# Altium schematic sheet Base_Schematic.SchDoc
size A4; SheetNumber: 1; SheetTotal: 2; ENG_APP_DATE: --/--/--; DSN_APP_DATE: --/--/--; CHK_APP_DATE: --/--/--
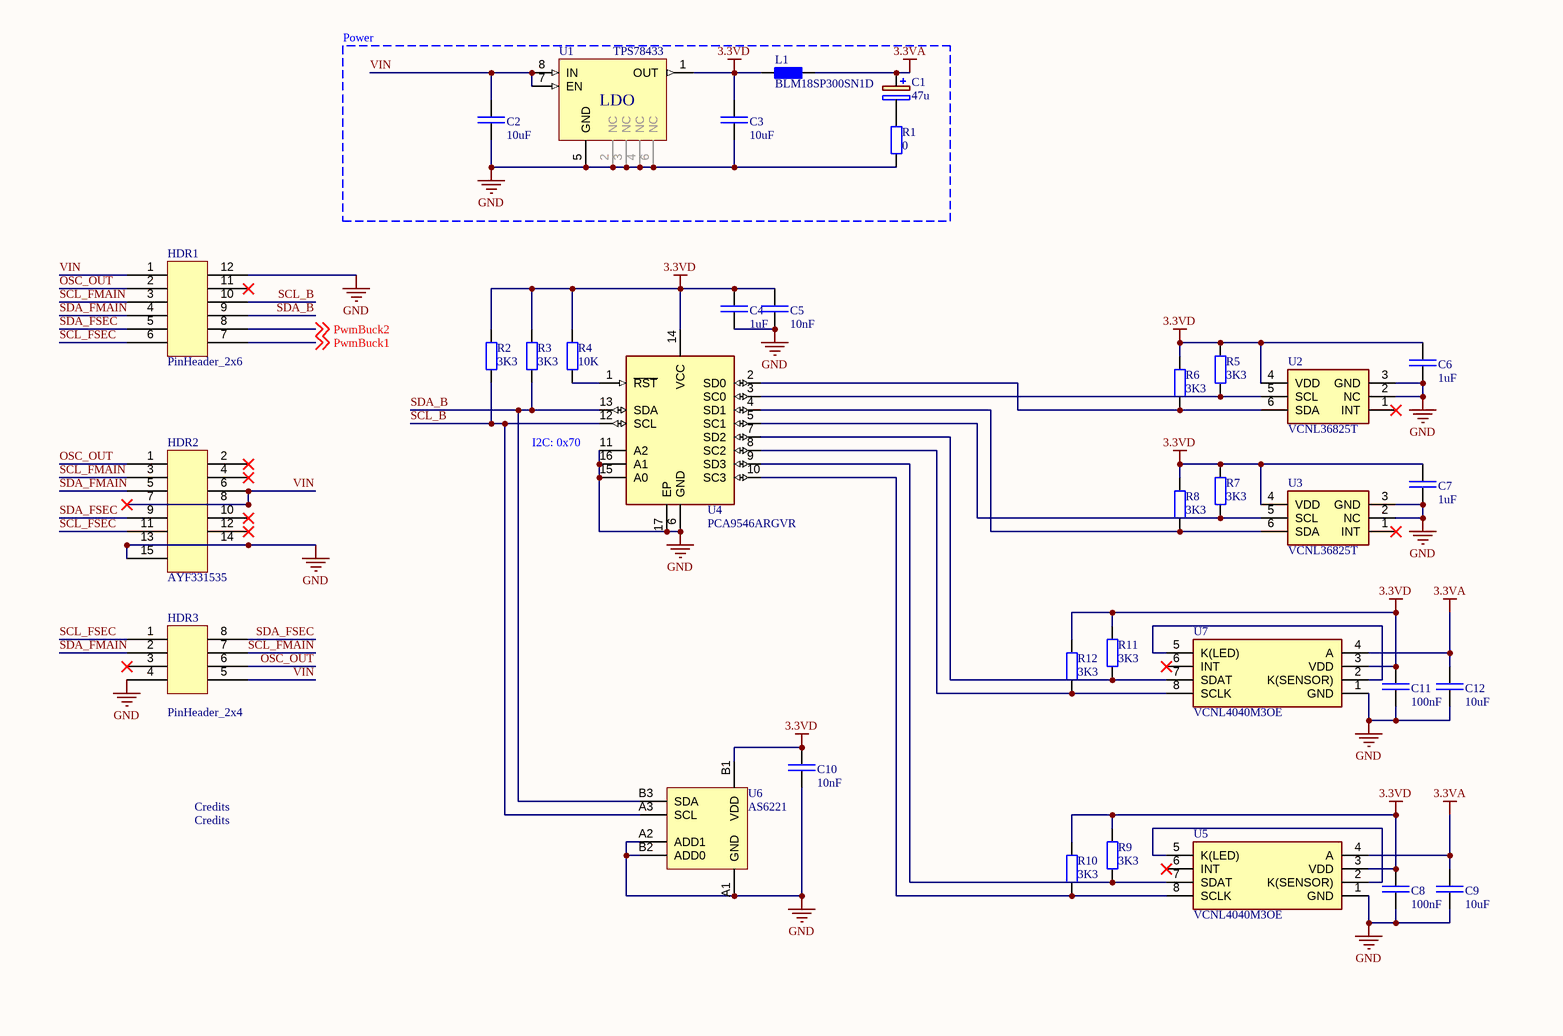
[diagram p0: Base_Schematic.SchDoc]

## Parts
C1  47u  [CAPAE7366X61N]
C2  10uF  [CAP_SM0805_YAGEOCC2_N]
C3  10uF  [CAP_SM0805_YAGEOCC2_N]
C4  1uF  [CAP_SM0805_YAGEOCC2_N]
C5  10nF  [CAP_SM0402_YAGEOCC2_N]
C6  1uF  [CAP_SM0805_YAGEOCC2_N]
C7  1uF  [CAP_SM0805_YAGEOCC2_N]
C8  100nF  [CAP_SM0603_YAGEOCC2_N]
C9  10uF  [CAP_SM0805_YAGEOCC2_N]
C10  10nF  [CAP_SM0402_YAGEOCC2_N]
C11  100nF  [CAP_SM0603_YAGEOCC2_N]
C12  10uF  [CAP_SM0805_YAGEOCC2_N]
Credit  Credits  [CREDITS_CU+TS_SIGNED]
HDR1  PinHeader_2x6  [PinHeader_2x6_2.54mm]
HDR2  AYF331535  [AYF331535 _Reverse]
HDR3  PinHeader_2x4  [PinHeader_2x4_2.54mm]
L1  BLM18SP300SN1D  [Chip2PinSM127P600-8N]
R1  0  [RES_SM0603_YAGEORC_N]
R2  3K3  [RES_SM0603_YAGEORC_N]
R3  3K3  [RES_SM0603_YAGEORC_N]
R4  10K  [RES_SM0603_YAGEORC_N]
R5  3K3  [RES_SM0603_YAGEORC_N]
R6  3K3  [RES_SM0603_YAGEORC_N]
R7  3K3  [RES_SM0603_YAGEORC_N]
R8  3K3  [RES_SM0603_YAGEORC_N]
R9  3K3  [RES_SM0603_YAGEORC_N]
R10  3K3  [RES_SM0603_YAGEORC_N]
R11  3K3  [RES_SM0603_YAGEORC_N]
R12  3K3  [RES_SM0603_YAGEORC_N]
U1  TPS78433  [TPS784xxxQDRBRQ1_SON]
U2  VCNL36825T  [VCNL36825T]
U3  VCNL36825T  [VCNL36825T]
U4  PCA9546ARGVR  [QFN65P400X400X100-17N-D]
U5  VCNL4040M3OE  [VCNL4040M3OE]
U6  AS6221  [AS6221_BGA_LargePads]
U7  VCNL4040M3OE  [VCNL4040M3OE]

## Blocks framed on the sheet
Power: C1-C3 L1 R1 U1

## Nets
3.3VA: C1.1(+) C9.1 C12.1 L1.2 U5.4(A) U7.4(A)
3.3VD: C3.1 C4.1 C5.1 C6.1 C7.1 C8.1 C10.1 C11.1 L1.1 R2.1 R3.1 R4.1 R5.2 R6.2 R7.2 R8.2 R9.2 R10.2 R11.2 R12.2 U1.1(OUT) U2.4(VDD) U3.4(VDD) U4.14(VCC) U5.3(VDD) U6.B1(VDD) U7.3(VDD)
GND: C2.2 C3.2 C4.2 C5.2 C6.2 C7.2 C8.2 C9.2 C10.2 C11.2 C12.2 HDR1.12 HDR2.13 HDR2.14 HDR2.15 HDR3.4 R1.1 U1.2(NC) U1.3(NC) U1.4(NC) U1.5(GND) U1.6(NC) U2.2(NC) U2.3(GND) U3.2(NC) U3.3(GND) U4.6(GND) U4.11(A2) U4.15(A0) U4.16(A1) U4.17(EP) U5.1(GND) U6.A1(GND) U6.A2(ADD1) U6.B2(ADD0) U7.1(GND)
OSC_OUT: HDR1.2 HDR2.1 HDR3.6
PwmBuck1: HDR1.7 ; off-sheet PwmBuck1
PwmBuck2: HDR1.8 ; off-sheet PwmBuck2
SCL_B: HDR1.10 R2.2 U4.12(SCL) U6.A3(SCL)
SCL_FMAIN: HDR1.3 HDR2.3 HDR3.7
SCL_FSEC: HDR1.6 HDR2.11 HDR3.1
SDA_B: HDR1.9 R3.2 U4.13(SDA) U6.B3(SDA)
SDA_FMAIN: HDR1.4 HDR2.5 HDR3.2
SDA_FSEC: HDR1.5 HDR2.9 HDR3.8
VIN: C2.1 HDR1.1 HDR2.6 HDR2.7 HDR2.8 HDR3.5 U1.7(EN) U1.8(IN)
NetC1_2: C1.2(-) R1.2
NetR4_2: R4.2 U4.1(~{RST})
NetR5_1: R5.1 U2.5(SCL) U4.3(SC0)
NetR6_1: R6.1 U2.6(SDA) U4.2(SD0)
NetR7_1: R7.1 U3.5(SCL) U4.5(SC1)
NetR8_1: R8.1 U3.6(SDA) U4.4(SD1)
NetR9_1: R9.1 U4.9(SD3) U5.7(SDAT)
NetR10_1: R10.1 U4.10(SC3) U5.8(SCLK)
NetR11_1: R11.1 U4.7(SD2) U7.7(SDAT)
NetR12_1: R12.1 U4.8(SC2) U7.8(SCLK)
NetU5_2: U5.2(K(SENSOR)) U5.5(K(LED))
NetU7_2: U7.2(K(SENSOR)) U7.5(K(LED))

Not connected (* = marked no-connect by the designer): HDR1 11*; HDR2 2* 4* 10* 12*; HDR3 3*; U2 1(INT)*; U3 1(INT)*; U5 6(INT)*; U7 6(INT)*

## Notes on the sheet
- (near U4) I2C: 0x70
- DWG. NO.
- REV.
- SHT.
- THIS DOCUMENT AND THE DATA DISCLOSED HEREIN OR HEREWITH IS THE PROPERTY OF ALTIUM LIMITED AND MAY BE FREELY DISTRIBUTED IN WHOLE. NO RIGHTS ARE RESERVED OR EXPRESS OR IMPLIED WARANTEE GIVEN.
- REVISION
- DESCRIPTION
- DATE
- APPROVED
- ENG:
- APPROVALS
- PROJECT
- DSN:
- CHK:
- REFERENCE DOCUMENTS
- PROJECT REVISION:
- TITLE
- DOCUMENT REVISION:
- DESIGN ITEM:
- BOM:
- FAB DWG:
- PCB DWG:
- ASSY DWG:
- SCALE:
- SIZE
- B
- CAGE CODE
- FILE NAME
- DWG NO.
- SHEET
- OF
- REV
- (in symbol TPS78433QWDRBRQ1) LDO

## Library data of the parts
C1 = EEE-FK1E470P: Aluminium Electrolytic Capacitors - SMD 47uF 25V; Value: 47u; Supplier 1: Mouser; Supplier Part Number 1: 667-EEE-FK1E470P; Supplier 2: Digi-Key; Supplier Part Number 2: PCE3804CT-ND; Supplier 3: Digi-Key; Supplier Part Number 3: PCE3804DKR-ND
C2 C3 C9 C12 = CC0805KKX5R8BB106: CAP 10uF SM0805 X5R 16V YAGEO CC2; Manufacturer Part Number: CC0805KKX7R8BB225; Tolerance (%): 10; Voltage Rating (Volts): 25; Category: Capacitor; Manufacturer: Yageo; Package: 0805; Value: 10uF; Supplier Part Number 1: 1988078; Supplier 1: Rs; ComponentLink1URL: http://www.yageo.com; ComponentLink1Description: Manufacturer Website; Supplier 2: Digikey; Supplier Part Number 2: 311-1869-1-ND; Supplier 3: Digikey; Supplier Part Number 3: 311-1869-6-ND; Supplier 4: Farnell; Supplier Part Number 4: 3369293; Supplier 5: Mouser; Supplier Part Number 5: 603-CC805KKX5R8BB106
C4 C6 C7 = CC0805KKX7R8BB105: CAP 1uF SM0805 X7R 25V YAGEO CC2; Tolerance (%): 10; Voltage Rating (Volts): 25; Category: Capacitor; Manufacturer: Yageo; Manufacturer Part Number: CC0805KKX7R8BB105; Package: 0805; Value: 1uF; ComponentLink1URL: http://www.yageo.com; ComponentLink1Description: Manufacturer Website; Supplier 1: Farnell; Supplier Part Number 1: 1458903; Supplier 2: Digikey; Supplier Part Number 2: 311-1456-1-ND; Supplier 3: Mouser; Supplier Part Number 3: 603-CC805KKX7R8BB105; Supplier 4: Future Electronics; Supplier Part Number 4: 7716954; Supplier 5: Arrow Electronics; Supplier Part Number 5: CC0805KKX7R8BB105; Supplier 6: Rs; Supplier Part Number 6: 1988104; Supplier 7: Digikey; Supplier Part Number 7: 311-1456-6-ND
C5 C10 = CC0402KRX7R9BB103: CAP 10nF SM0402 X7R 50V YAGEO CC2; Manufacturer Part Number: CC0603KRX7R9BB103; Tolerance (%): 10; Voltage Rating (Volts): 50; Category: Capacitor; Manufacturer: Yageo; Package: 0603; Value: 10nF; Supplier Part Number 1: 3369167; Supplier 1: Farnell; ComponentLink1URL: http://www.yageo.com; ComponentLink1Description: Manufacturer Website; Supplier 2: Mouser; Supplier Part Number 2: 603-CC402KRX7R9BB103; Supplier 3: DigiKey; Supplier Part Number 3: 311-1349-1-ND
C8 C11 = CC0603KRX7R9BB104: CAP 100nF SM0603 X7R 50V YAGEO CC2; Tolerance (%): 10; Voltage Rating (Volts): 50; Category: Capacitor; Manufacturer: Yageo; Manufacturer Part Number: CC0603KRX7R9BB104; Package: 0603; Value: 100nF; ComponentLink1URL: http://www.yageo.com; ComponentLink1Description: Manufacturer Website; Supplier 1: Mouser; Supplier Part Number 1: 603-CC603KRX7R9BB104; Supplier 2: Future Electronics; Supplier Part Number 2: 3035896; Supplier 3: Future Electronics; Supplier Part Number 3: 9017302; Supplier 4: Arrow Electronics; Supplier Part Number 4: CC0603KRX7R9BB104; Supplier 5: Rs; Supplier Part Number 5: 6698767; Supplier 6: Avnet; Supplier Part Number 6: 68R4788; Supplier 7: Digikey; Supplier Part Number 7: 311-1344-1-ND; Supplier 8: Digikey; Supplier Part Number 8: 311-1344-6-ND
HDR1 = PinHeader_2x6_2.54mm: PinHeader_2x6 2.54mm Pitch
HDR2 = AYF331535: AYF331535 FFC & FPC-Steckverbinder CONNECTOR SURFACE MOUNT; Supplier 1: Mouser; Supplier Part Number 1: 769-AYF331535; Supplier 2: Digi-Key; Supplier Part Number 2: 255-3053-1-ND
HDR3 = PinHeader_2x4_2.54mm: PinHeader_2x4 2.54mm Pitch
L1 = BLM18SP300SN1D: Ferrite Beads 0603 30ohm 10% 6A; Manufacturer_Name: Murata Electronics; Geometry.Height: 0.95mm; Mouser Part Number: 81-BLM18SP300SN1D; Mouser Price/Stock: https://www.mouser.co.uk/ProductDetail/Murata-Electronics/BLM18SP300SN1D?qs=W%2FMpXkg%252BdQ4o%252BOP%252B6m8FYA%3D%3D; Manufacturer_Part_Number: BLM18SP300SN1D; Datasheet Link: http://www.murata.com/~/media/webrenewal/support/library/catalog/products/emc/emifil/c31e.ashx?la=en-gb; Supplier 1: Digi-Key; Supplier Part Number 1: 490-BLM18SP300SN1DCT-ND; Supplier 2: Digi-Key; Supplier Part Number 2: 490-BLM18SP300SN1DDKR-ND; Supplier 3: Mouser; Supplier Part Number 3: 81-BLM18SP300SN1D
R1 = RC0603FR-070RL: RES 0R SM0603 YAGEO RC_L; Manufacturer Part Number: RC0603FR-0710KL; Power (Watts): 0.1; Resistance (Ohms): 10000; Tolerance (%): 1; Category: Resistor; Manufacturer: Yageo; Package: 0603; Value: 0; ComponentLink1URL: http://www.yageo.com; ComponentLink1Description: Manufacturer Website; Supplier 1: Digikey; Supplier Part Number 1: 311-0.0HRCT-ND; Supplier 2: Digikey; Supplier Part Number 2: 311-0.0HRDKR-ND; Supplier 3: Farnell; Supplier Part Number 3: 2309106; Supplier 4: Mouser; Supplier Part Number 4: 603-RC0603FR-070RL; Supplier 5: Newark; Supplier Part Number 5: 50Y7761
R2 R3 R5-R12 = RC0603FR-073K3L: RES 3K3 SM0603 YAGEO RC_L; Manufacturer Part Number: RC0603FR-0710KL; Power (Watts): 0.1; Resistance (Ohms): 10000; Tolerance (%): 1; Category: Resistor; Manufacturer: Yageo; Package: 0603; Value: 3K3; Supplier Part Number 1: 1995564; Supplier 1: Rs; ComponentLink1URL: http://www.yageo.com; ComponentLink1Description: Manufacturer Website; Supplier 2: Farnell; Supplier Part Number 2: 9238549; Supplier 3: Digikey; Supplier Part Number 3: 311-3.30KHRCT-ND; Supplier 4: Digikey; Supplier Part Number 4: 311-3.30KHRDKR-ND; Supplier 5: Mouser; Supplier Part Number 5: 603-RC0603FR-073K3L; Supplier 6: Newark; Supplier Part Number 6: 98K7393
R4 = RC0603FR-0710KL: RES 10K SM0603 YAGEO RC_L; Power (Watts): 0.1; Resistance (Ohms): 10000; Tolerance (%): 1; Category: Resistor; Manufacturer: Yageo; Manufacturer Part Number: RC0603FR-0710KL; Package: 0603; Value: 10K; Supplier Part Number 1: 9238603; Supplier 1: Farnell; ComponentLink1URL: http://www.yageo.com; ComponentLink1Description: Manufacturer Website; Supplier 2: Future Electronics; Supplier Part Number 2: 3349388; Supplier 3: Rs; Supplier Part Number 3: 1995443; Supplier 4: Digikey; Supplier Part Number 4: 311-10.0KHRCT-ND; Supplier 5: Digikey; Supplier Part Number 5: 311-10.0KHRDKR-ND; Supplier 6: Mouser; Supplier Part Number 6: 603-RC0603FR-0710KL; Supplier 7: Newark; Supplier Part Number 7: 98K7338
U1 = TPS78433QWDRBRQ1: TPS78433-Q1 3.3V, 300-mA, High-PSRR Low-Dropout Voltage Regulator With High Accuracy and Enable,  8-SON (3x3); Supplier 1: Mouser; Supplier Part Number 1: 595-TPS78433QWDRBRQ1; Supplier 2: Digikey; Supplier Part Number 2: 296-TPS78433QWDRBRQ1CT-ND; Supplier 3: Texas Instruments; Supplier Part Number 3: TPS78433QWDRBRQ1; Supplier 4: Digikey; Supplier Part Number 4: 296-TPS78433QWDRBRQ1DKR-ND; Supplier 5: Digikey; Supplier Part Number 5: 296-TPS78433QWDRBRQ1TR-ND; Supplier 6: LCSC; Supplier Part Number 6: C3747465
U2 U3 = VCNL36825T: Proximity Sensors PROX SENS INTER VCSEL I2C-E4, IC SENSORS; Manufacturer_Name: Vishay; Geometry.Height: 0.6mm; Mouser Part Number: 78-VCNL36825T; Mouser Price/Stock: https://www.mouser.co.uk/ProductDetail/Vishay-Semiconductors/VCNL36825T?qs=pUKx8fyJudAlmgCr9cmOAQ%3D%3D; Manufacturer_Part_Number: VCNL36825T; Datasheet Link: https://www.vishay.com/docs/80235/vcnl36825t.pdf; Supplier 1: Mouser; Supplier Part Number 1: 78-VCNL36825T; Supplier 2: Digi-Key; Supplier Part Number 2: 751-VCNL36825TCT-ND; Supplier 3: Digi-Key; Supplier Part Number 3: 751-VCNL36825TDKR-ND
U4 = PCA9546ARGVR: 4-Channel I2C And SMBus Switch With Reset Functions; Manufacturer_Name: Texas Instruments; Geometry.Height: 1mm; Mouser Part Number: 595-PCA9546ARGVR; Mouser Price/Stock: https://www.mouser.co.uk/ProductDetail/Texas-Instruments/PCA9546ARGVR?qs=iSMark9AYDVOIxSBd0ujBA%3D%3D; Manufacturer_Part_Number: PCA9546ARGVR; Datasheet Link: http://www.ti.com/lit/gpn/pca9546a; Supplier 1: Mouser; Supplier Part Number 1: 595-PCA9546ARGVR; Supplier 2: Digi-Key; Supplier Part Number 2: 296-21771-1-ND; Supplier 3: Digi-Key; Supplier Part Number 3: 296-21771-6-ND
U5 U7 = VCNL4040M3OE: Fully Integrated Proximity and Ambient Light Sensor with Infrared Emitter, I2C Interface, and Interrupt Function; Manufacturer_Name: Vishay; Geometry.Height: 1.15mm; Mouser Part Number: 78-VCNL4040M3OE; Mouser Price/Stock: https://www.mouser.co.uk/ProductDetail/Vishay-Semiconductors/VCNL4040M3OE?qs=p1ya7m3AA0C%252Buyxak4%252Bv6g%3D%3D; Manufacturer_Part_Number: VCNL4040M3OE; Datasheet Link: http://www.vishay.com/docs/84274/vcnl4040.pdf; Supplier 1: Mouser; Supplier Part Number 1: 78-VCNL4040M3OE; Supplier 2: Digi-Key; Supplier Part Number 2: VCNL4040M3OECT-ND; Supplier 3: Digi-Key; Supplier Part Number 3: VCNL4040M3OEDKR-ND
U6 = AS6221-AWLT-S: AS6221 Temperature Sensor Digital -40°C ~ 125°C 16b 6-WLCSP (1.5x1.03); Supplier 1: Mouser; Supplier Part Number 1: 985-AS6221-AWLT-S; Supplier 2: Digikey; Supplier Part Number 2: 4991-AS6221-AWLT-SCT-ND; Supplier 3: Arrow Electronics; Supplier Part Number 3: AS6221-AWLT-S; Supplier 4: Future Electronics; Supplier Part Number 4: 1136541; Supplier 5: Digikey; Supplier Part Number 5: 4991-AS6221-AWLT-SDKR-ND; Supplier 6: Digikey; Supplier Part Number 6: 4991-AS6221-AWLT-STR-ND; Supplier 7: Avnet; Supplier Part Number 7: Q65114A1149